# EAGLE design dynalo (EAGLE 9.1.3)
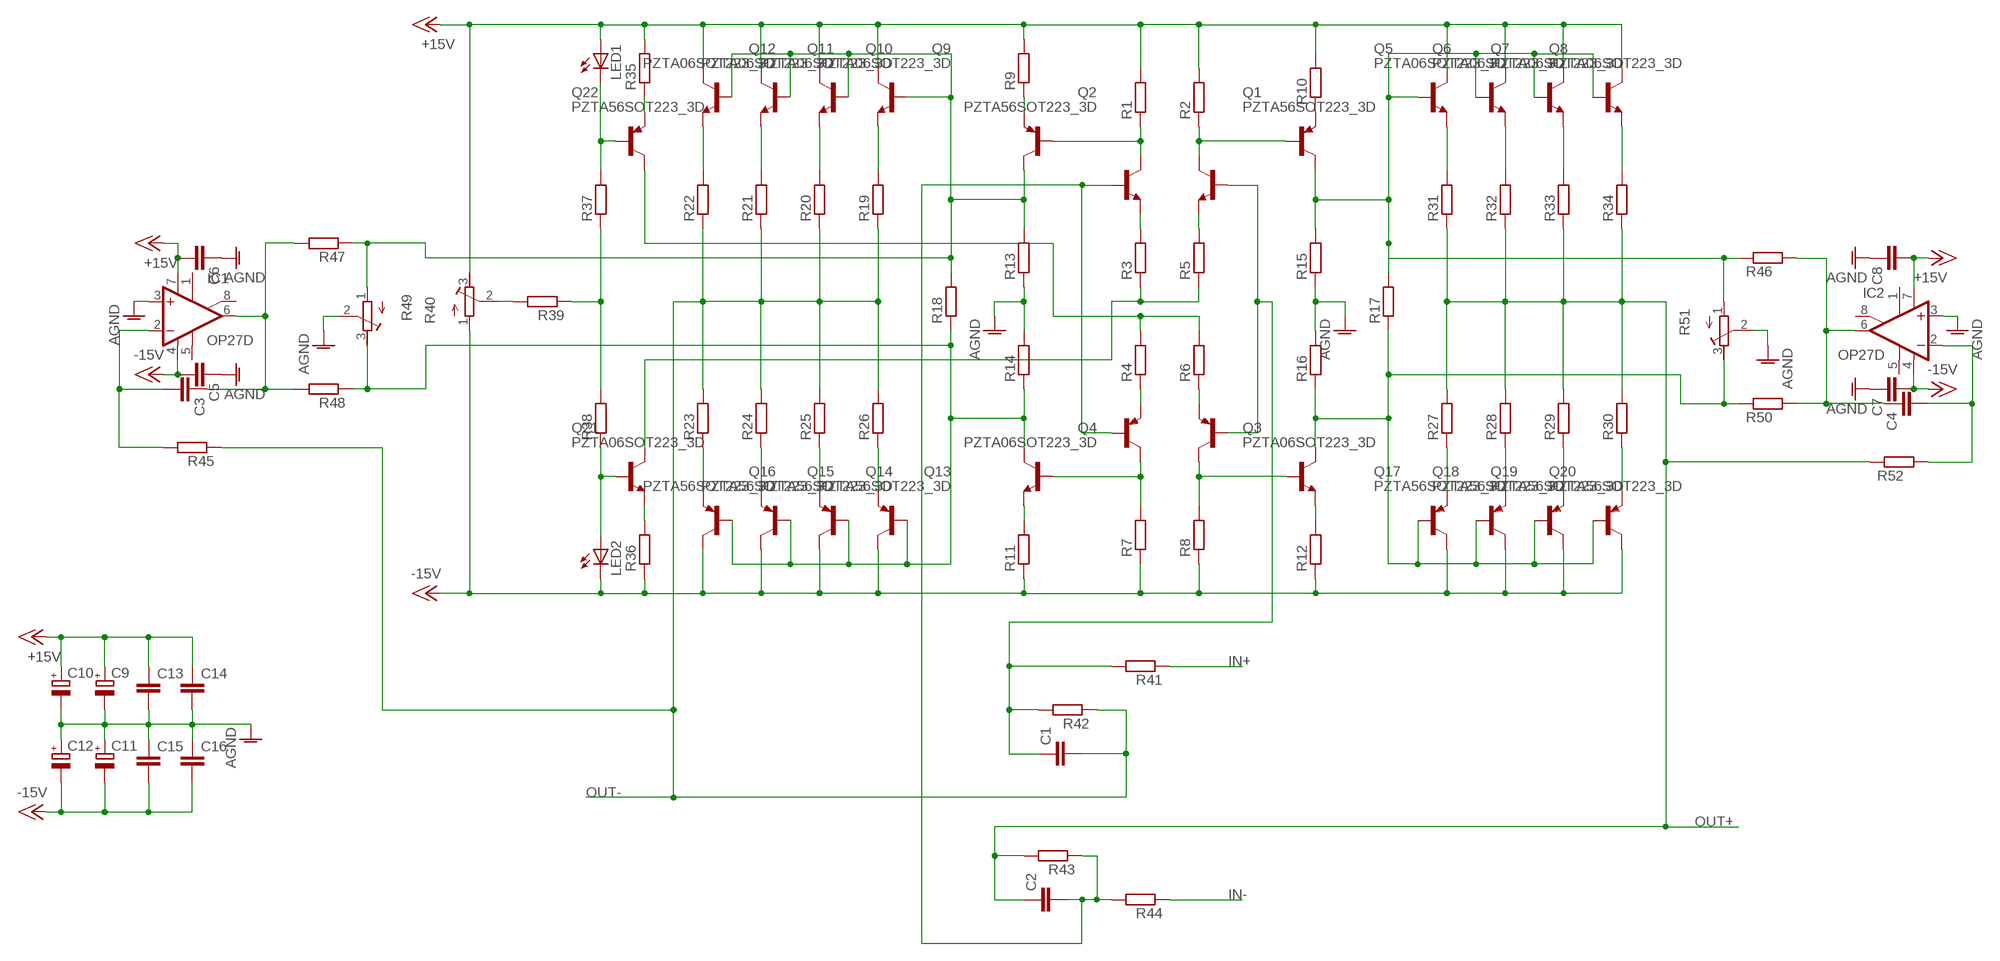
[diagram p0: schematic, sheet 1]

## Parts
C1  C-EUC0805K  [C0805K]
C2  C-EUC0805K  [C0805K]
C3  C-EUC0805K  [C0805K]
C4  C-EUC0805K  [C0805K]
C5  C-EUC0805K  [C0805K]
C6  C-EUC0805K  [C0805K]
C7  C-EUC0805K  [C0805K]
C8  C-EUC0805K  [C0805K]
C9  CPOL-EUE5-10.5  [E5-10,5]
C10  CPOL-EUE5-10.5  [E5-10,5]
C11  CPOL-EUE5-10.5  [E5-10,5]
C12  CPOL-EUE5-10.5  [E5-10,5]
C13  C-EU050-035X075  [C050-035X075]
C14  C-EU050-035X075  [C050-035X075]
C15  C-EU050-035X075  [C050-035X075]
C16  C-EU050-035X075  [C050-035X075]
IC1  OP27D  [SO08]
IC2  OP27D  [SO08]
LED1  LED5MM  [LED5MM]
LED2  LED5MM  [LED5MM]
Q1  PZTA56SOT223_3D  [SOT230P700X180-4]
Q2  PZTA56SOT223_3D  [SOT230P700X180-4]
Q3  PZTA06SOT223_3D  [SOT230P700X180-4]
Q4  PZTA06SOT223_3D  [SOT230P700X180-4]
Q5  PZTA06SOT223_3D  [SOT230P700X180-4]
Q6  PZTA06SOT223_3D  [SOT230P700X180-4]
Q7  PZTA06SOT223_3D  [SOT230P700X180-4]
Q8  PZTA06SOT223_3D  [SOT230P700X180-4]
Q9  PZTA06SOT223_3D  [SOT230P700X180-4]
Q10  PZTA06SOT223_3D  [SOT230P700X180-4]
Q11  PZTA06SOT223_3D  [SOT230P700X180-4]
Q12  PZTA06SOT223_3D  [SOT230P700X180-4]
Q13  PZTA56SOT223_3D  [SOT230P700X180-4]
Q14  PZTA56SOT223_3D  [SOT230P700X180-4]
Q15  PZTA56SOT223_3D  [SOT230P700X180-4]
Q16  PZTA56SOT223_3D  [SOT230P700X180-4]
Q17  PZTA56SOT223_3D  [SOT230P700X180-4]
Q18  PZTA56SOT223_3D  [SOT230P700X180-4]
Q19  PZTA56SOT223_3D  [SOT230P700X180-4]
Q20  PZTA56SOT223_3D  [SOT230P700X180-4]
Q21  PZTA06SOT223_3D  [SOT230P700X180-4]
Q22  PZTA56SOT223_3D  [SOT230P700X180-4]
R1  R-EU_MMA0204  [RESMELF3413]
R2  R-EU_MMA0204  [RESMELF3413]
R3  R-EU_MMA0204  [RESMELF3413]
R4  R-EU_MMA0204  [RESMELF3413]
R5  R-EU_MMA0204  [RESMELF3413]
R6  R-EU_MMA0204  [RESMELF3413]
R7  R-EU_MMA0204  [RESMELF3413]
R8  R-EU_MMA0204  [RESMELF3413]
R9  R-EU_MMA0204  [RESMELF3413]
R10  R-EU_MMA0204  [RESMELF3413]
R11  R-EU_MMA0204  [RESMELF3413]
R12  R-EU_MMA0204  [RESMELF3413]
R13  R-EU_MMA0204  [RESMELF3413]
R14  R-EU_MMA0204  [RESMELF3413]
R15  R-EU_MMA0204  [RESMELF3413]
R16  R-EU_MMA0204  [RESMELF3413]
R17  R-EU_MMA0204  [RESMELF3413]
R18  R-EU_MMA0204  [RESMELF3413]
R19  R-EU_MMA0204  [RESMELF3413]
R20  R-EU_MMA0204  [RESMELF3413]
R21  R-EU_MMA0204  [RESMELF3413]
R22  R-EU_MMA0204  [RESMELF3413]
R23  R-EU_MMA0204  [RESMELF3413]
R24  R-EU_MMA0204  [RESMELF3413]
R25  R-EU_MMA0204  [RESMELF3413]
R26  R-EU_MMA0204  [RESMELF3413]
R27  R-EU_MMA0204  [RESMELF3413]
R28  R-EU_MMA0204  [RESMELF3413]
R29  R-EU_MMA0204  [RESMELF3413]
R30  R-EU_MMA0204  [RESMELF3413]
R31  R-EU_MMA0204  [RESMELF3413]
R32  R-EU_MMA0204  [RESMELF3413]
R33  R-EU_MMA0204  [RESMELF3413]
R34  R-EU_MMA0204  [RESMELF3413]
R35  R-EU_MMA0204  [RESMELF3413]
R36  R-EU_MMA0204  [RESMELF3413]
R37  R-EU_MMA0204  [RESMELF3413]
R38  R-EU_MMA0204  [RESMELF3413]
R39  R-EU_MELF0204W  [MINI_MELF-0204W]
R40  R-TRIMM3296W  [RTRIM3296W]
R41  R-EU_MMA0204  [RESMELF3413]
R42  R-EU_MMA0204  [RESMELF3413]
R43  R-EU_MMA0204  [RESMELF3413]
R44  R-EU_MMA0204  [RESMELF3413]
R45  R-EU_MMA0204  [RESMELF3413]
R46  R-EU_MMA0204  [RESMELF3413]
R47  R-EU_MMA0204  [RESMELF3413]
R48  R-EU_MMA0204  [RESMELF3413]
R49  R-TRIMM3296W  [RTRIM3296W]
R50  R-EU_MMA0204  [RESMELF3413]
R51  R-TRIMM3296W  [RTRIM3296W]
R52  R-EU_MMA0204  [RESMELF3413]
U$1  TRANSISTOR-ARRAYS_THAT340THAT3403D  [DIP762W53P254L1969H508Q14A]

## Nets
+15V: C6.2 C8.2 C9.+ C10.+ C13.1 C14.1 IC1.7(V+) IC2.7(V+) LED1.A Q5.2(C) Q5.4(C) Q6.2(C) Q6.4(C) Q7.2(C) Q7.4(C) Q8.2(C) Q8.4(C) Q9.2(C) Q9.4(C) Q10.2(C) Q10.4(C) Q11.2(C) Q11.4(C) Q12.2(C) Q12.4(C) R1.2 R2.2 R9.2 R10.2 R35.2 R40.3(E)
-15V: C5.2 C7.2 C11.- C12.- C15.2 C16.2 IC1.4(V-) IC2.4(V-) LED2.K(C) Q13.2(C) Q13.4(C) Q14.2(C) Q14.4(C) Q15.2(C) Q15.4(C) Q16.2(C) Q16.4(C) Q17.2(C) Q17.4(C) Q18.2(C) Q18.4(C) Q19.2(C) Q19.4(C) Q20.2(C) Q20.4(C) R7.1 R8.1 R11.1 R12.1 R36.1 R40.1(A)
AGND: C5.1 C6.1 C7.1 C8.1 C9.- C10.- C11.+ C12.+ C13.2 C14.2 C15.1 C16.1 IC1.3(+IN) IC2.3(+IN) R13.1 R14.2 R15.1 R16.2 R49.2(S) R51.2(S)
IN+: R41.1
IN-: R44.1
N$1: R3.2 U$1.12(E)
N$2: R4.1 U$1.10(E)
N$3: R5.2 U$1.3(E)
N$4: R6.1 U$1.5(E)
N$5: Q22.2(C) Q22.4(C) R4.2 R6.2
N$6: Q21.2(C) Q21.4(C) R3.1 R5.1
N$7: Q2.1(B) R1.1 U$1.14(C)
N$8: Q1.1(B) R2.1 U$1.1(C)
N$11: Q3.1(B) R8.2 U$1.7(C)
N$12: Q4.1(B) R7.2 U$1.8(C)
N$13: Q2.3(E) R9.1
N$14: Q1.3(E) R10.1
N$15: Q4.3(E) R11.2
N$16: Q12.3(E) R22.2
N$17: Q11.3(E) R21.2
N$18: Q3.3(E) R12.2
N$19: Q2.2(C) Q2.4(C) Q9.1(B) Q10.1(B) Q11.1(B) Q12.1(B) R13.2 R18.2 R47.1 R49.1(A)
N$20: Q10.3(E) R20.2
N$21: Q4.2(C) Q4.4(C) Q13.1(B) Q14.1(B) Q15.1(B) Q16.1(B) R14.1 R18.1 R48.1 R49.3(E)
N$22: Q3.2(C) Q3.4(C) Q17.1(B) Q18.1(B) Q19.1(B) Q20.1(B) R16.1 R17.1 R50.1 R51.3(E)
N$23: Q9.3(E) R19.2
N$24: Q1.2(C) Q1.4(C) Q5.1(B) Q6.1(B) Q7.1(B) Q8.1(B) R15.2 R17.2 R46.1 R51.1(A)
N$25: C1.1 R41.2 R42.2 U$1.2(B) U$1.6(B)
N$26: C2.2 R43.1 R44.2 U$1.9(B) U$1.13(B)
N$27: Q13.3(E) R26.1
N$28: Q14.3(E) R25.1
N$29: Q15.3(E) R24.1
N$30: Q16.3(E) R23.1
N$31: Q17.3(E) R27.1
N$32: Q18.3(E) R28.1
N$33: Q19.3(E) R29.1
N$34: Q20.3(E) R30.1
N$35: Q8.3(E) R34.2
N$36: Q7.3(E) R33.2
N$37: Q6.3(E) R32.2
N$38: Q5.3(E) R31.2
N$41: C3.1 IC1.6(OUT) R47.2 R48.2
N$42: Q21.3(E) R36.2
N$43: LED2.A Q21.1(B) R38.1
N$44: C3.2 IC1.2(-IN) R45.2
N$45: Q22.3(E) R35.1
N$46: LED1.K(C) Q22.1(B) R37.2
N$47: C4.1 IC2.6(OUT) R46.2 R50.2
N$48: R37.1 R38.2 R39.1
N$49: R39.2 R40.2(S)
N$50: C4.2 IC2.2(-IN) R52.2
OUT+: C2.1 R27.2 R28.2 R29.2 R30.2 R31.1 R32.1 R33.1 R34.1 R43.2 R52.1
OUT-: C1.2 R19.1 R20.1 R21.1 R22.1 R23.2 R24.2 R25.2 R26.2 R42.1 R45.1
Unconnected: IC1.1(ON1) IC1.5(OPT) IC1.8(ON2) IC2.1(ON1) IC2.5(OPT) IC2.8(ON2)

## Library data of the parts
C1-C8 C13-C16 = Vwvwbg:C-EU: CAPACITOR, European symbol
C9-C12 = Vwvwbg:CPOL-EU: POLARIZED CAPACITOR, European symbol
IC1 IC2 = linear:OP27: OP AMP
LED1 LED2 = Vwvwbg:LED: LED OSRAM: - CHIPLED LG R971, LG N971, LY N971, LG Q971, LY Q971, LO R971, LY R971 LH N974, LH R974 LS Q976, LO Q976, LY Q976 LO Q996 - Hyper CHIPLED LW Q18S LB Q993, LB Q99A, LB R99A - SideLED LS A670, LO A670, LY A670, LG A670, LP A670 LB A673, LV A673, LT A673, LW A673 LH A674 LY A675 LS A676, LA A676, LO A676, LY A676, LW A676 LS A679, LY A679, LG A679 - Hyper Micro SIDELED® LS Y876, LA Y876, LO Y876, LY Y876 LT Y87S - SmartLED LW L88C, LW L88S LB L89C, LB L89S, LG L890 LS L89K, LO L89K, LY L89K LS L896, LA L896, LO L896, LY L896 - TOPLED LS T670, LO T670, LY T670, LG T670, LP T670 LSG T670, LSP T670, LSY T670, LOP T670, LYG T670 LG T671, LOG T671, LSG T671 LB T673, LV T673, LT T673, LW T673 LH T674 LS T676, LA T676, LO T676, LY T676, LB T676, LH T676, LSB T676, LW T676 LB T67C, LV T67C, LT T67C, LS T67K, LO T67K, LY T67K, LW E67C LS E67B, LA E67B, LO E67B, LY E67B, LB E67C, LV E67C, LT E67C LW T67C LS T679, LY T679, LG T679 LS T770, LO T770, LY T770, LG T770, LP T770 LB T773, LV T773, LT T773, LW T773 LH T774 LS E675, LA E675, LY E675, LS T675 LS T776, LA T776, LO T776, LY T776, LB T776 LHGB T686 LT T68C, LB T68C - Hyper Mini TOPLED® LB M676 - Mini TOPLED Santana® LG M470 LS M47K, LO M47K, LY M47K Source: http://www.osram.convergy.de LUXEON: - LUMILED® LXK2-PW12-R00, LXK2-PW12-S00, LXK2-PW14-U00, LXK2-PW14-V00 LXK2-PM12-R00, LXK2-PM12-S00, LXK2-PM14-U00 LXK2-PE12-Q00, LXK2-PE12-R00, LXK2-PE12-S00, LXK2-PE14-T00, LXK2-PE14-U00 LXK2-PB12-K00, LXK2-PB12-L00, LXK2-PB12-M00, LXK2-PB14-N00, LXK2-PB14-P00, LXK2-PB14-Q00 LXK2-PR12-L00, LXK2-PR12-M00, LXK2-PR14-Q00, LXK2-PR14-R00 LXK2-PD12-Q00, LXK2-PD12-R00, LXK2-PD12-S00 LXK2-PH12-R00, LXK2-PH12-S00 LXK2-PL12-P00, LXK2-PL12-Q00, LXK2-PL12-R00 Source: www.luxeon.com KINGBRIGHT: KA-3528ASYC Source: www.kingbright.com
Q1 Q2 Q13-Q20 Q22 = Vwvwbg:PZTA56
Q3-Q12 Q21 = Vwvwbg:PZTA06
R1-R39 R41-R48 R50 R52 = Vwvwbg:R-EU_: RESISTOR, European symbol
R40 R49 R51 = Vwvwbg:R-TRIMM: Trimm resistor
U$1 = Vwvwbg:TRANSISTOR-ARRAYS_THAT340

## Board
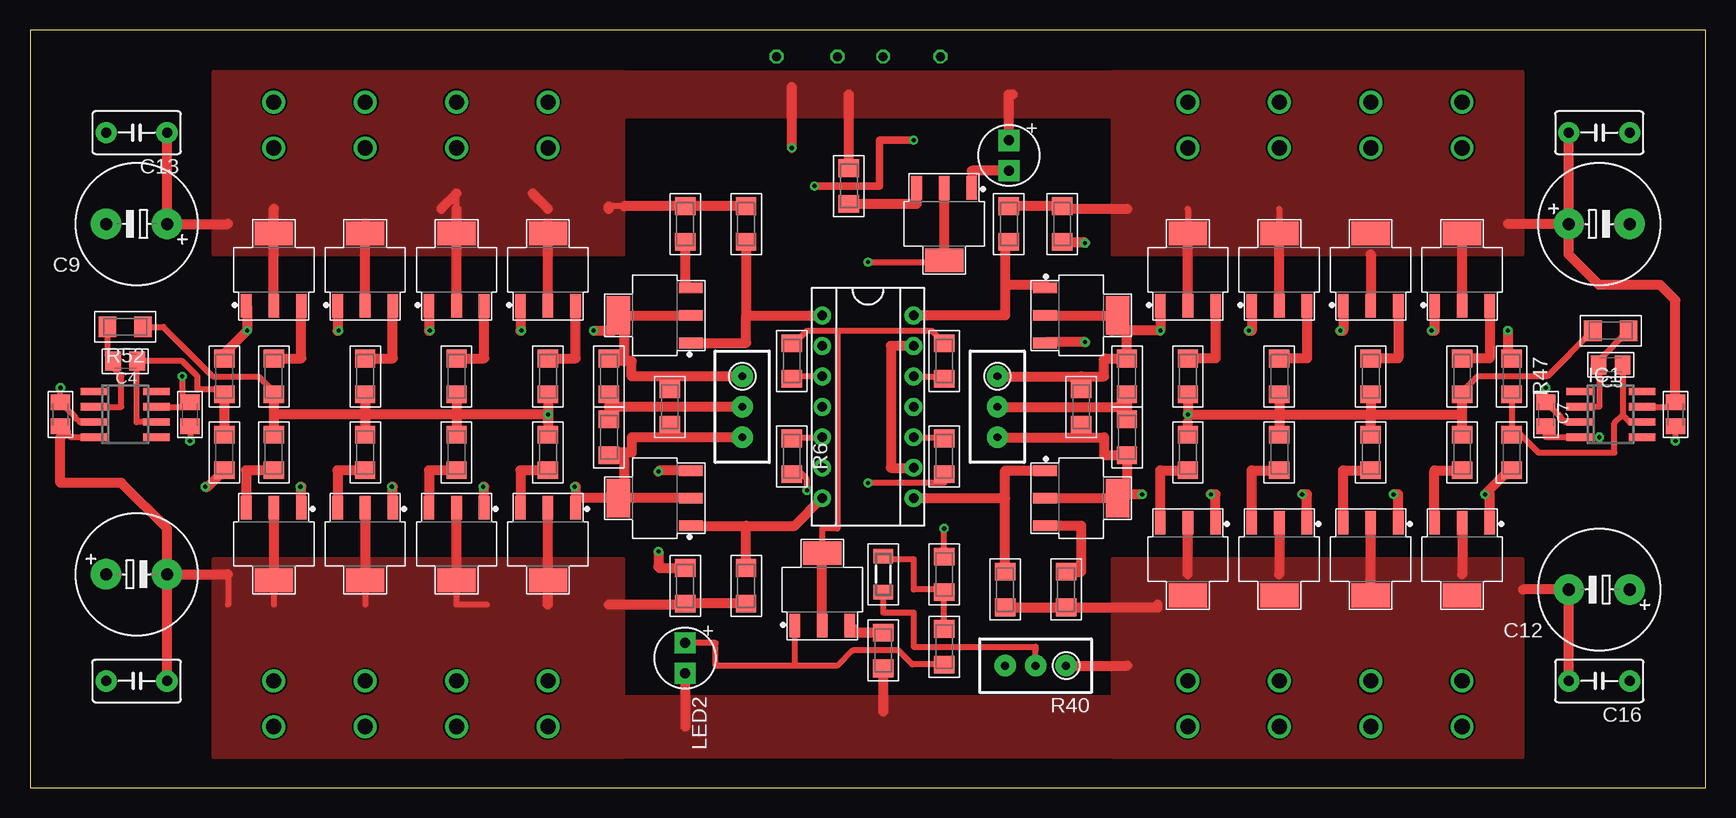
[diagram p1: board, top side]
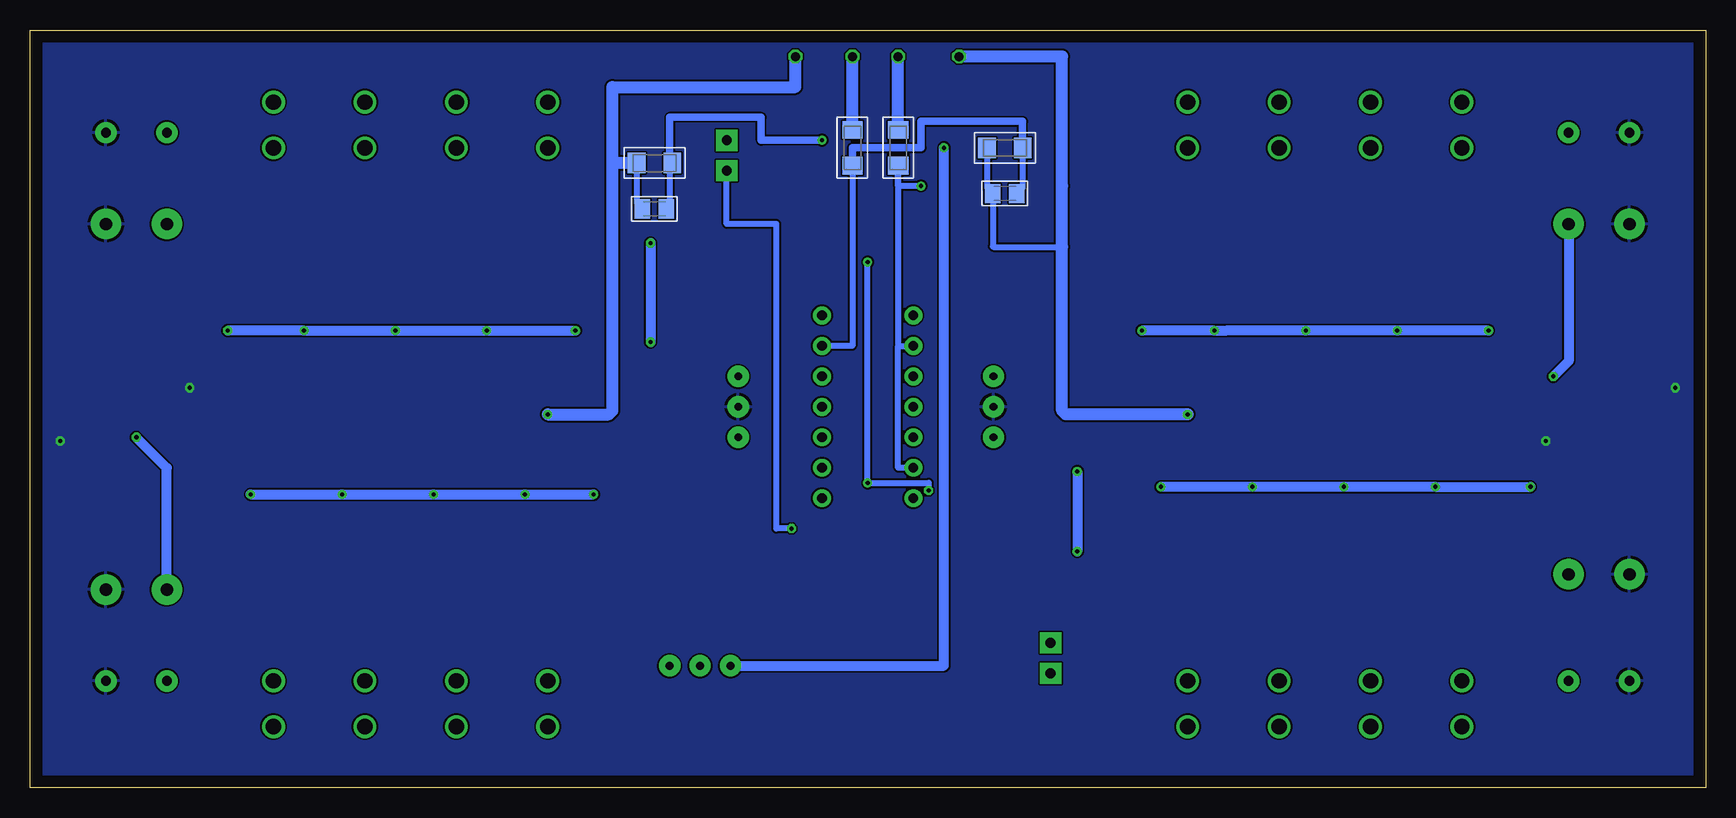
[diagram p2: board, bottom side, seen from below]

Size 139.68 x 63.17 mm. Coordinates in mm from the lower left corner, seen from the top.
Outline: 0,0 139.68,0 139.68,63.17 0,63.17 0,0
Copper layers (1*16): Top 0.035mm / dielectric 1.5mm / Bottom 0.035mm
Design rules "default": minimum track width 6mil, minimum drill 0.35mm, track to track 6mil, track to pad 6mil, pad to pad 6mil, via to via 6mil, smd to smd 6mil, copper to edge 40mil, drill to drill 6mil, minimum pad ring 10mil, minimum via ring 8mil, stop-mask expansion 4mil, vias tented up to drill 0mil, thermal gap 10mil

### Footprints (pad centres in the part's own frame; a part is rotated, then mirrored left to right if it is on the bottom)
C0805K = smd 1.3 x 1.6: 1 -1,0; 2 1,0
E5-10,5 = drill 1.016 pad 2.54: + -2.54,0; - 2.54,0
C050-035X075 = drill 0.813 pad 1.778: 1 -2.54,0; 2 2.54,0
SO08 = smd 0.6 x 2.2: 1 -1.905,-2.6; 2 -0.635,-2.6; 3 0.635,-2.6; 4 1.905,-2.6; 5 1.905,2.6; 6 0.635,2.6; 7 -0.635,2.6; 8 -1.905,2.6
LED5MM = drill 0.813 pad 1.778 square: A -1.27,0; K 1.27,0
SOT230P700X180-4 = smd 1.965 x 0.889: 1 -3.023,2.3; 2 -3.023,0; 3 -3.023,-2.3 | smd 1.965 x 3.189: 4 3.023,0
RESMELF3413 = smd 1.471 x 1.702: 1 -1.487,0; 2 1.487,0
MINI_MELF-0204W = smd 1.2 x 1.6: 1 -1.5,0; 2 1.5,0
RTRIM3296W = drill 0.65 pad 1.778: 1 0,-2.54; 2 0,0; 3 0,2.54
DIP762W53P254L1969H508Q14A = drill 0.793 pad 1.493: 1 -3.81,7.62; 2 -3.81,5.08; 3 -3.81,2.54; 4 -3.81,0; 5 -3.81,-2.54; 6 -3.81,-5.08; 7 -3.81,-7.62; 8 3.81,-7.62; 9 3.81,-5.08; 10 3.81,-2.54; 11 3.81,0; 12 3.81,2.54; 13 3.81,5.08; 14 3.81,7.62

### Placement (x,y rotation side)
C1  87.63,48.26 180 bottom
C2  58.42,49.53 0 bottom
C3  131.76,35.24 180 top
C4  7.94,35.56 180 top
C5  2.54,31.11 270 top
C6  13.34,31.11 90 top
C7  126.36,31.11 270 top
C8  137.16,31.11 90 top
C9  8.89,46.99 180 top
C10  130.81,46.99 0 top
C11  8.89,17.78 0 top
C12  130.81,16.51 180 top
C13  8.89,54.61 180 top
C14  130.81,54.61 0 top
C15  8.89,8.89 0 top
C16  130.81,8.89 180 top
IC1  131.76,31.11 270 top
IC2  7.94,31.11 270 top
LED1  81.6,52.7 270 top
LED2  54.61,10.79 270 top
Q1  52.07,39.37 180 top
Q2  87.63,39.37 0 top
Q3  52.07,24.13 180 top
Q4  87.63,24.13 0 top
Q5  43.18,43.18 90 top
Q6  35.56,43.18 90 top
Q7  27.94,43.18 90 top
Q8  20.32,43.18 90 top
Q9  96.52,43.18 90 top
Q10  104.14,43.18 90 top
Q11  111.76,43.18 90 top
Q12  119.38,43.18 90 top
Q13  119.38,19.05 270 top
Q14  111.76,19.05 270 top
Q15  104.14,19.05 270 top
Q16  96.52,19.05 270 top
Q17  20.32,20.32 270 top
Q18  27.94,20.32 270 top
Q19  35.56,20.32 270 top
Q20  43.18,20.32 270 top
Q21  66.04,16.51 90 top
Q22  76.2,46.99 270 top
R1  81.6,46.99 90 top
R2  59.69,46.99 90 top
R3  76.2,35.56 270 top
R4  76.2,27.62 270 top
R5  63.5,35.56 270 top
R6  63.5,27.62 270 top
R7  81.28,16.51 90 top
R8  59.69,16.83 90 top
R9  86.04,46.99 90 top
R10  54.61,46.99 90 top
R11  86.36,16.51 90 top
R12  54.61,16.83 90 top
R13  91.44,34.29 90 top
R14  91.44,29.21 90 top
R15  48.26,34.29 90 top
R16  48.26,29.21 90 top
R17  53.34,31.75 90 top
R18  87.63,31.75 90 top
R19  96.52,34.29 90 top
R20  104.14,34.29 90 top
R21  111.76,34.29 90 top
R22  119.38,34.29 90 top
R23  96.52,27.94 90 top
R24  104.14,27.94 90 top
R25  111.76,27.94 90 top
R26  119.38,27.94 90 top
R27  20.32,27.94 90 top
R28  27.94,27.94 90 top
R29  35.56,27.94 90 top
R30  43.18,27.94 90 top
R31  43.18,34.29 90 top
R32  35.56,34.29 90 top
R33  27.94,34.29 90 top
R34  20.32,34.29 90 top
R35  68.26,50.16 90 top
R36  71.12,11.43 90 top
R37  76.2,17.78 90 top
R38  76.2,11.75 90 top
R39  71.12,17.78 270 top
R40  83.82,10.16 90 top
R41  67.31,53.34 270 bottom
R42  87.63,52.07 0 bottom
R43  58.42,53.34 180 bottom
R44  71.12,53.34 270 bottom
R45  131.76,38.1 0 top
R46  16.19,34.29 270 top
R47  123.51,34.29 270 top
R48  123.51,27.94 90 top
R49  80.64,31.75 180 top
R50  16.19,27.94 90 top
R51  59.37,31.75 180 top
R52  7.94,38.42 180 top
U$1  69.85,31.75 0 top

### Tracks (layer width: path | path; a pad name or v marks a point on that pad's centre or on a via)
+15V  (via drill 0.35)
  Top 0.508: IC2.7 12.7,31.75 | 12.7,31.75 12.97,31.75 C6.2 | IC1.7 136.79,31.75 C8.2 | v12.7,34.29 12.7,31.75 | 49.53,48.48 48.26,48.48 48.04,48.26 | 35.56,48.26 35.56,49.53 | 20.32,46.99 20.32,44.45 | 96.52,48.26 96.52,44.45 | 104.14,48.26 104.14,44.45
  Top 0.813: R35.2 68.26,57.78 | LED1.A 81.6,57.78 81.92,57.78 | R2.2 R10.2 49.53,48.48 | 48.26,48.48 48.26,48.26 | Q5.2 43.18,46.99 | Q6.2 35.56,48.26 | Q7.2 27.94,45.72 27.94,46.99 | Q8.2 20.32,44.45 20.32,46.99 20.32,48.26 | Q9.2 96.52,44.45 96.52,45.72 | Q10.2 104.14,44.45 104.14,45.72 | 111.76,44.45 Q11.2 | Q12.2 119.38,45.72 | v63.5,53.34 63.5,58.42 | R1.2 R9.2 86.26,48.26 91.44,48.26 | 16.51,46.99 C9.+ C13.1 | C8.2 137.16,40.64 135.89,41.91 130.81,41.91 128.27,44.45 C10.+ | C10.+ C14.1 | C10.+ 123.19,46.99 | 34.29,48.26 35.56,49.53 | 43.18,48.26 41.91,49.53
  Bottom 0.813: R40.3 63.5,10.16 v63.5,53.34 | C9.+ 11.43,35.56 v12.7,34.29
  pour Top (no thermals): 15.24,59.69 15.24,44.45 49.53,44.45 49.53,59.69
  pour Top (no thermals): 90.17,59.69 90.17,44.45 124.46,44.45 124.46,59.69
  pour Top (no thermals): 49.53,59.69 90.17,59.69 90.17,55.88 49.53,55.88
-15V  (via drill 0.35)
  Top 0.508: IC2.4 3.44,29.21 2.99,29.66 C5.2 | C7.2 126.36,29.21 IC1.4 v130.81,29.21 | 38.1,15.24 35.56,15.24 35.56,16.51 | Q18.4 27.94,15.24 | Q17.4 20.32,15.24 | 16.51,17.78 16.51,15.24
  Top 0.813: 59.59,15.24 R8.1 R12.1 54.51,15.24 48.26,15.24 | Q18.2 27.94,16.51 | 35.56,16.51 Q19.2 | 43.18,15.24 Q20.2 | R7.1 R11.1 93.98,15.02 93.98,15.24 | R36.1 71.12,6.35 | LED2.K 54.61,5.08 | R40.1 91.44,10.16 | 96.52,17.78 Q16.2 | Q15.2 104.14,17.78 | 111.76,16.51 Q14.2 | Q13.2 119.38,17.78 | Q17.2 20.32,16.51 | C11.- 16.51,17.78 | C15.2 C11.- | C11.- 11.43,21.59 7.62,25.4 2.54,25.4 2.54,29.21 2.99,29.66 | 124.46,16.51 C12.- C16.2
  Bottom 0.813: C12.- 128.27,26.67 v130.81,29.21
  pour Top (no thermals): 15.24,19.05 15.24,2.54 49.53,2.54 49.53,19.05
  pour Top (no thermals): 90.17,19.05 90.17,2.54 124.46,2.54 124.46,19.05
  pour Top (no thermals): 49.53,7.62 90.17,7.62 90.17,2.54 49.53,2.54
AGND  (via drill 0.35)
  Top 0.508: IC1.3 128,30.48 127.57,30.91 127.57,30.93 127.33,31.17 127.31,31.17 C7.1 v126.36,33.34 | C8.1 v137.16,28.89 | C6.1 v13.34,28.89 | v2.54,33.34 C5.1 3.48,31.17 3.51,31.17 3.75,30.93 3.75,30.91 4.17,30.48 IC2.3
  Top 0.813: R15.1 48.26,31.75 | 48.26,31.75 R16.2 | R51.2 48.26,31.75 | R13.1 91.44,31.75 | 91.44,31.75 R14.2 | R49.2 91.44,31.75
  pour Bottom: 0,63.5 139.7,63.5 139.7,0 0,0
IN+  (via drill 0.75)
  Bottom 1.016: R41.1 v67.31,60.96
IN-  (via drill 0.75)
  Bottom 1.016: R44.1 v71.12,60.96
N$1
  Top 0.508: U$1.12 75.98,34.29 R3.2
N$2
  Top 0.508: U$1.10 76.1,29.21 R4.1
N$3
  Top 0.508: U$1.3 63.72,34.29 R5.2
N$4
  Top 0.508: R6.1 63.6,29.21 U$1.5
N$5  (via drill 0.35)
  Top 0.508: R4.2 76.2,25.4 v69.85,25.4 | Q22.4 76.2,43.81 71.12,43.81 70.8,43.81 v69.85,43.81 | v64.77,24.77 64.77,25.72 64.14,26.35 63.92,26.14 R6.2
  Top 0.813: Q22.2 Q22.4
  Bottom 0.508: v69.85,43.81 v69.85,25.4 64.77,25.4 v64.77,24.77
N$6
  Top 0.508: R5.1 63.72,37.05 64.77,38.1 67.31,38.1 | 67.31,38.1 68.58,38.1 75.15,38.1 R3.1 | 67.31,38.1 67.31,21.59 66.04,21.59 Q21.4
  Top 0.813: Q21.2 Q21.4
N$7
  Top 0.813: Q2.1 84.61,41.91 81.28,41.91 | 81.28,41.91 81.28,39.37 U$1.14 | R1.1 81.28,45.5 81.28,41.91
N$8
  Top 0.813: 59.69,39.37 U$1.1 | R2.1 59.69,39.37 | Q1.1 59.69,37.07 59.69,39.37
N$9  (via drill 1.27)
  other vias: 20.32,8.89
N$10  (via drill 1.27)
  other vias: 27.94,8.89
N$11
  Top 0.813: Q3.1 59.69,21.83 | 59.69,21.83 63.74,21.83 U$1.7 | R8.2 59.69,21.83
N$12
  Top 0.813: R7.2 81.28,24.13 | 81.28,24.13 81.28,26.43 Q4.1 | U$1.8 81.28,24.13
N$13  (via drill 0.35)
  Top 0.813: R9.1 87.85,45.5 v87.95,45.4 | v87.95,37.15 84.69,37.15 Q2.3
  Bottom 0.813: v87.95,45.4 v87.95,37.15
N$14
  Top 0.813: Q1.3 54.61,41.67 R10.1
N$15
  Top 0.813: R11.2 87.63,18 87.63,21.83 Q4.3
N$16
  Top 0.813: Q12.3 121.68,35.78 R22.2
N$17
  Top 0.813: Q11.3 114.06,35.78 R21.2
N$18  (via drill 0.35)
  Top 0.813: Q3.3 52.47,26.43 v52.39,26.35 | v52.39,19.68 52.39,18.41 52.49,18.32 R12.2
  Bottom 0.813: v52.39,26.35 v52.39,19.68
N$19  (via drill 0.35)
  Top 0.813: R49.1 87.63,34.29 | 87.63,34.29 89.53,34.29 89.53,35.78 R13.2 91.44,38.1 | R18.2 87.63,34.29 | Q2.2 Q2.4 90.17,39.37 90.17,38.1 91.44,38.1 | Q9.1 v94.22,38.1 91.44,38.1 | Q12.1 117.08,38.1 v116.84,38.1 | Q10.1 101.84,38.1 v101.6,38.1 | Q11.1 109.46,38.1 v109.22,38.1 | v123.19,38.1 123.19,36.09 R47.1
  Bottom 0.813: v94.22,38.1 v101.6,38.1 v109.22,38.1 v116.84,38.1 v123.19,38.1
N$20
  Top 0.813: Q10.3 106.44,35.78 R20.2
N$21  (via drill 0.35)
  Top 0.508: 91.12,27.41 R14.1
  Top 0.813: R49.3 87.63,29.21 | 87.63,29.21 89.53,29.21 89.53,27.72 R14.1 91.44,24.45 | R18.1 87.63,29.21 | Q4.2 Q4.4 91.12,24.13 91.44,24.45 | Q13.1 121.68,24.45 v121.28,24.45 123.29,26.45 R48.1 | v92.71,24.45 91.44,24.45 | 91.44,24.45 91.12,24.45 91.12,24.77 | Q16.1 98.82,24.45 v98.42,24.45 | Q15.1 106.44,24.45 v106.05,24.45 | Q14.1 114.06,24.45 v113.67,24.45
  Bottom 0.813: v121.28,24.45 v113.67,24.45 v106.05,24.45 v98.42,24.45 v92.71,24.45
N$22  (via drill 0.35)
  Top 0.813: Q3.2 Q3.4 | R51.3 53.34,29.21 | 53.34,29.21 50.16,29.21 50.16,27.94 49.53,27.94 | 49.53,27.94 48.48,27.94 R16.1 | R17.1 53.34,29.21 | Q3.4 49.53,24.61 49.53,27.94 | Q3.4 45.72,24.13 45.48,23.89 | 45.48,23.89 Q20.1 | Q17.1 22.62,25.08 v22.54,25.08 | v45.4,25.08 45.48,25.08 45.48,23.89 | Q19.1 37.86,25.08 v37.78,25.08 | Q18.1 30.24,25.08 v30.16,25.08 | v14.61,25.08 14.82,25.08 R50.1
  Bottom 0.813: v45.4,25.08 v37.78,25.08 v30.16,25.08 v22.54,25.08 v14.61,25.08
N$23
  Top 0.813: Q9.3 98.82,35.78 R19.2
N$24  (via drill 0.35)
  Top 0.813: R51.1 53.34,34.29 | 53.34,34.29 50.16,34.29 50.16,35.56 49.53,35.56 | 49.53,35.56 48.48,35.56 R15.2 | R17.2 53.34,34.29 | Q1.4 Q1.2 | Q1.4 49.53,38.89 49.53,35.56 | Q8.1 18.1,40.16 v18.1,38.1 16.19,36.2 R46.1 | v46.99,38.1 48.58,38.1 | 48.58,38.1 48.58,39.05 | Q5.1 40.88,38.1 v40.96,38.1 | Q6.1 33.26,38.1 v33.34,38.1 | Q7.1 25.64,38.1 v25.72,38.1 | Q1.4 49.05,38.57 48.58,38.1
  Bottom 0.813: v18.1,38.1 v25.72,38.1 v33.34,38.1 40.01,38.1 v40.96,38.1 v46.99,38.1
N$25  (via drill 0.35)
  Top 0.61: v73.66,53.98 70.8,53.98 70.8,50.16 v65.41,50.16
  Bottom 0.508: 67.31,36.83 R41.2 67.31,50.16 v65.41,50.16 | 67.31,36.83 U$1.2 | R42.2 86.36,51.85 86.36,48.26 C1.1 | U$1.6 67.31,26.67 67.31,36.83
  Bottom 0.61: v73.66,53.98 78.74,53.98 78.74,55.88 86.36,55.88 86.36,51.85
N$26
  Top 0.813: U$1.9 71.75,26.67 71.75,36.83 U$1.13
  Bottom 0.508: R44.2 71.12,36.83 U$1.13 | R43.1 56.93,50.02 C2.2
  Bottom 0.61: R44.2 71.12,53.34 65.41,53.34 65.41,55.56 56.93,55.56 R43.1
N$27
  Top 0.813: Q13.3 117.08,26.45 R26.1
N$28
  Top 0.813: Q14.3 109.46,26.45 R25.1
N$29
  Top 0.813: Q15.3 101.84,26.45 R24.1
N$30
  Top 0.813: Q16.3 94.22,26.45 R23.1
N$31
  Top 0.813: R27.1 18.02,26.45 Q17.3
N$32
  Top 0.813: R28.1 25.64,26.45 Q18.3
N$33
  Top 0.813: R29.1 33.26,26.45 Q19.3
N$34
  Top 0.813: R30.1 40.88,26.45 Q20.3
N$35
  Top 0.813: R34.2 22.62,35.78 Q8.3
N$36
  Top 0.813: R33.2 30.24,35.78 Q7.3
N$37
  Top 0.813: R32.2 37.86,35.78 Q6.3
N$38
  Top 0.813: R31.2 45.48,35.78 Q5.3
N$39  (via drill 1.27)
  other vias: 35.56,8.89
N$40  (via drill 1.27)
  other vias: 43.18,8.89
N$41
  Top 0.508: C3.1 132.76,31.07 | 132.76,31.07 133.35,30.48 IC1.6 | R47.2 R48.2 124.24,29.43 125.73,27.94 132.08,27.94 132.08,30.39 132.76,31.07
N$42
  Top 0.813: R36.2 68.91,12.92 Q21.3
N$43
  Top 0.508: R38.1 73.56,10.26 72.39,11.43 68.58,11.43 67.31,10.16 63.82,10.16 | LED2.A 57.15,12.06 57.15,10.16 63.5,10.16 63.82,10.16 | Q21.1 63.74,10.24 63.82,10.16
N$44
  Top 0.508: C3.2 130.81,35.2 | 130.81,35.2 130.81,31.75 IC1.2 | R45.2 130.81,35.66 130.81,35.2
N$45
  Top 0.813: R35.1 73.9,48.68 Q22.3
N$46  (via drill 0.35)
  Top 0.508: R37.2 v76.2,21.59
  Top 0.813: LED1.K 78.5,51.44 Q22.1
  Bottom 0.508: v76.2,21.59 77.47,21.59 77.47,46.99 81.6,46.99 LED1.K
N$47
  Top 0.508: IC2.6 8.89,30.48 8.89,35.51 8.91,35.54 | 8.91,35.54 C4.1 | 15.82,33.17 R46.2 15.82,33.17 | C4.1 8.91,35.54 | 15.82,33.17 13.97,33.17 13.97,34.29 12.7,35.56 C4.1 | C4.1 8.91,35.54
  Top 0.813: R46.2 R50.2
N$48
  Top 0.508: R39.1 71.35,19.05 73.66,19.05 73.66,16.51 76.2,16.51 R37.1 R38.2
N$49
  Top 0.508: R39.2 71.12,14.61 73.66,14.61 73.66,11.75 83.82,11.75 83.82,11.43 R40.2
N$50
  Top 0.508: R52.2 6.45,36.05 C4.2 6.99,35.51 6.99,34.92 7.62,34.29 7.62,31.75 IC2.2
N$51  (via drill 1.27)
  other vias: 96.52,8.89
N$52  (via drill 1.27)
  other vias: 104.14,8.89
N$53  (via drill 1.27)
  other vias: 111.76,8.89
N$54  (via drill 1.27)
  other vias: 119.38,8.89
N$55  (via drill 1.27)
  other vias: 20.32,53.34
N$56  (via drill 1.27)
  other vias: 27.94,53.34
N$57  (via drill 1.27)
  other vias: 35.56,53.34
N$58  (via drill 1.27)
  other vias: 43.18,53.34
N$59  (via drill 1.27)
  other vias: 96.52,53.34
N$60  (via drill 1.27)
  other vias: 104.14,53.34
N$61  (via drill 1.27)
  other vias: 111.76,53.34
N$62  (via drill 1.27)
  other vias: 119.38,53.34
N$63  (via drill 1.27)
  other vias: 20.32,57.15
N$64  (via drill 1.27)
  other vias: 27.94,57.15
N$65  (via drill 1.27)
  other vias: 35.56,57.15
N$66  (via drill 1.27)
  other vias: 43.18,57.15
N$67  (via drill 1.27)
  other vias: 96.52,57.15
N$68  (via drill 1.27)
  other vias: 104.14,57.15
N$69  (via drill 1.27)
  other vias: 111.76,57.15
N$70  (via drill 1.27)
  other vias: 119.38,57.15
N$71  (via drill 1.27)
  other vias: 119.38,5.08
N$72  (via drill 1.27)
  other vias: 111.76,5.08
N$73  (via drill 1.27)
  other vias: 104.14,5.08
N$74  (via drill 1.27)
  other vias: 96.52,5.08
N$75  (via drill 1.27)
  other vias: 43.18,5.08
N$76  (via drill 1.27)
  other vias: 35.56,5.08
N$77  (via drill 1.27)
  other vias: 27.94,5.08
N$78  (via drill 1.27)
  other vias: 20.32,5.08
OUT+  (via drill 0.35, 0.75)
  Top 0.508: R52.1 11.11,38.42 15.24,34.29 19.05,34.29 20.32,33.02 R34.1
  Top 0.813: R34.1 20.32,31.11 | 20.32,31.11 R27.2 | R33.1 27.94,31.11 | 27.94,31.11 27.94,30.48 R28.2 | R32.1 35.56,31.11 | 35.56,31.11 R29.2 | R31.1 v43.18,31.11 | v43.18,31.11 43.18,30.48 | 43.18,30.48 R30.2 | 43.18,30.48 v43.18,31.11 | v43.18,31.11 35.56,31.11 | 35.56,31.11 27.94,31.11 | 27.94,31.11 20.32,31.11
  Bottom 0.508: R43.2 59.91,50.02 C2.1 59.42,45.13 59.37,45.09 53.66,45.09
  Bottom 1.016: v62.23,60.96 53.66,60.96 53.66,50.16 53.66,45.09 53.66,31.43 53.34,31.11 v43.18,31.11
OUT-  (via drill 0.35, 0.75)
  Top 0.508: 96.52,30.48 v96.52,31.11 | R45.1 126.47,34.29 120.65,34.29 119.38,33.02 R22.1
  Top 0.813: R19.1 v96.52,31.11 104.14,31.11 | R23.2 96.52,30.48 | 119.38,31.11 R22.1 | 104.14,31.11 111.76,31.11 | 111.76,31.11 119.38,31.11 | R26.2 119.38,31.11 | R21.1 111.76,31.11 | R25.2 111.76,31.11 | R20.1 104.14,31.11 | 104.14,31.11 R24.2
  Bottom 0.508: R42.1 89.12,48.75 C1.2
  Bottom 1.016: v96.52,31.11 91.44,31.11 91.12,31.43 91.12,52.07 | 91.12,52.07 91.12,55.88 91.12,58.42 75.88,58.42 v75.88,60.96 | R42.1 91.12,52.07